# EAGLE design m1k-pot-divider (EAGLE 7.7.0)
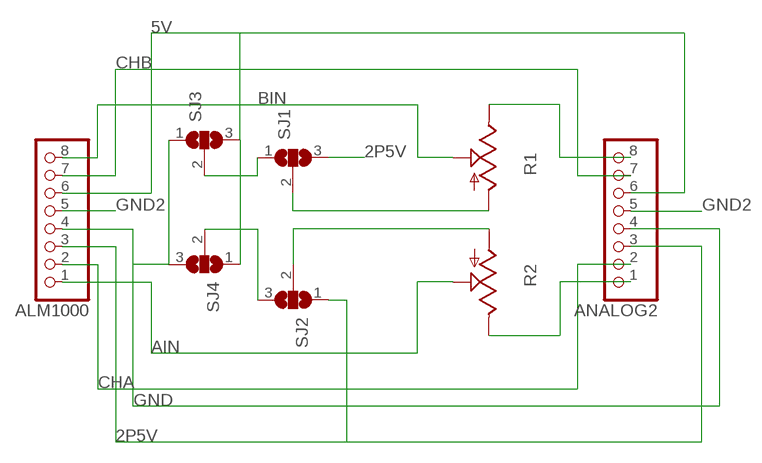
[diagram p0: schematic, sheet 1]

## Parts
ALM1000  PINHD-1X8  [1X08]
ANALOG2  PINHD-1X8  [1X08]
R1  TRIM_US-S64W  [S64W]
R2  TRIM_US-S64W  [S64W]
SJ1  SJ2W  [SJ_2]
SJ2  SJ2W  [SJ_2]
SJ3  SJ2W  [SJ_2]
SJ4  SJ2W  [SJ_2]

## Nets
2P5V: ALM1000.3 ANALOG2.3 SJ1.3 SJ2.1
5V: ALM1000.6 ANALOG2.6 SJ3.3 SJ4.1
AIN: ALM1000.1 R2.S
BIN: ALM1000.8 R1.S
CHA: ALM1000.2 ANALOG2.2
CHB: ALM1000.7 ANALOG2.7
GND: ALM1000.4 ANALOG2.4 SJ3.1 SJ4.3
GND2: ALM1000.5 ANALOG2.5
N$1: SJ1.1 SJ3.2
N$2: SJ2.3 SJ4.2
N$3: ANALOG2.1 R2.E
N$4: R1.A SJ1.2
N$5: R2.A SJ2.2
N$6: ANALOG2.8 R1.E

## Library data of the parts
ALM1000 ANALOG2 = pinhead:PINHD-1X8: PIN HEADER
R1 R2 = pot:TRIM_US-: POTENTIOMETER
SJ1-SJ4 = jumper:SJ2W: SMD solder JUMPER

## Board
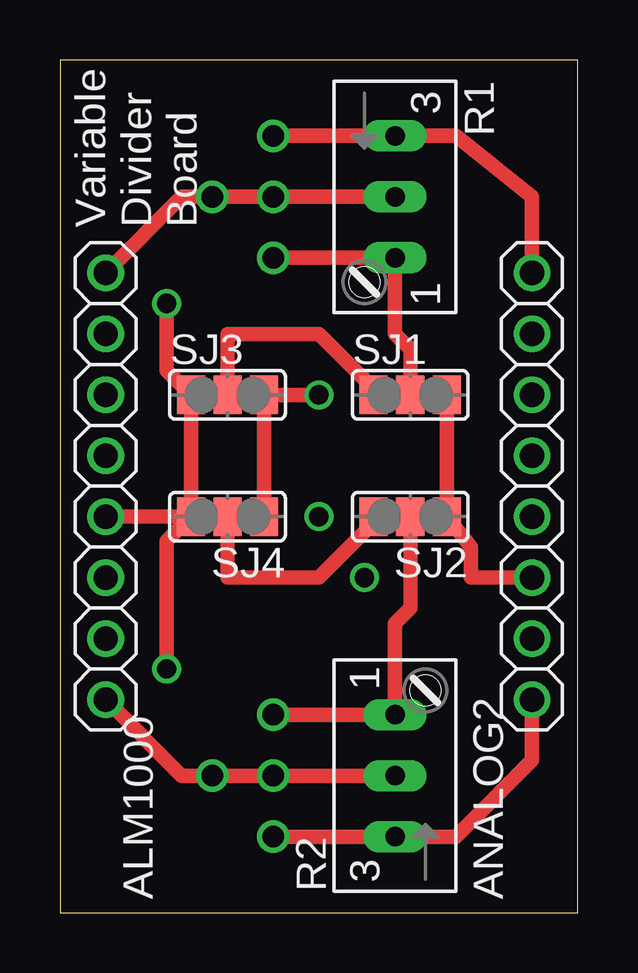
[diagram p1: board, top side]
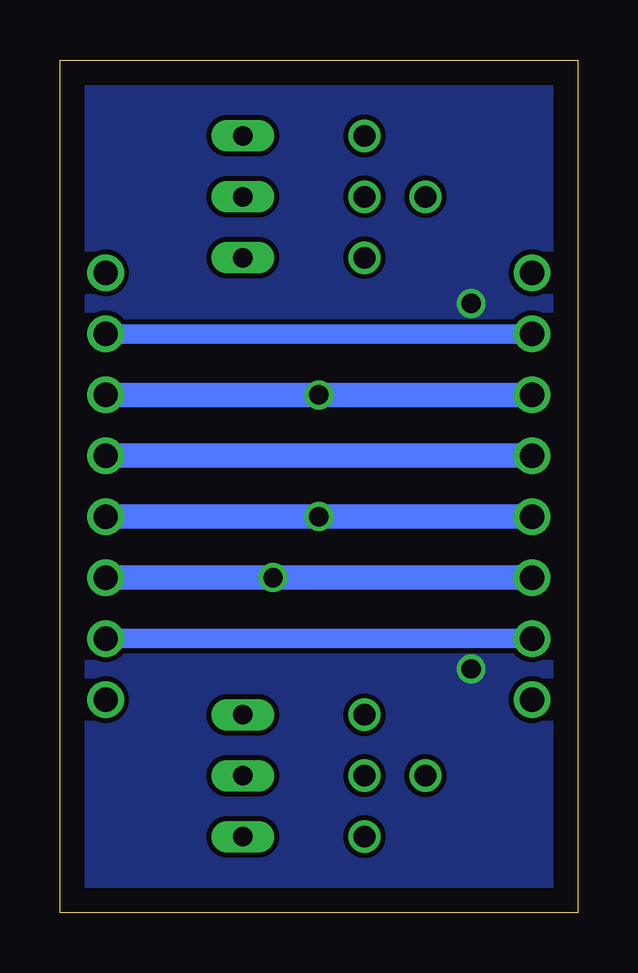
[diagram p2: board, bottom side, seen from below]

Size 21.59 x 35.55 mm. Coordinates in mm from the lower left corner, seen from the top.
Outline: 0,0 21.59,0 21.59,35.55 0,35.55 0,0
Copper layers (1*16): Top 0.035mm / dielectric 1.5mm / Bottom 0.035mm
Design rules "default": minimum track width 10mil, minimum drill 24mil, track to track 8mil, track to pad 8mil, pad to pad 8mil, via to via 8mil, smd to smd 8mil, copper to edge 40mil, drill to drill 8mil, minimum pad ring 10mil, minimum via ring 8mil, stop-mask expansion 4mil, vias tented up to drill 0mil, thermal gap 10mil

### Footprints (pad centres in the part's own frame; a part is rotated, then mirrored left to right if it is on the bottom)
1X08 = drill 1.016: 1 -8.89,0; 2 -6.35,0; 3 -3.81,0; 4 -1.27,0; 5 1.27,0; 6 3.81,0; 7 6.35,0; 8 8.89,0
S64W = drill 0.813 long: A 2.54,1.27; E -2.54,1.27; S 0,1.27
SJ_2 = smd 1.168 x 1.6: 1 -1.524,0; 2 0,0; 3 1.524,0

### Placement (x,y rotation side)
ALM1000  1.91,17.78 90 top
ANALOG2  19.68,17.78 90 top
R1  12.7,29.84 270 top
R2  15.24,5.71 90 top
SJ1  14.61,21.59 0 top
SJ2  14.61,16.51 180 top
SJ3  6.99,21.59 0 top
SJ4  6.99,16.51 180 top

### Tracks (layer width: path | path; a pad name or v marks a point on that pad's centre or on a via)
2P5V  (via drill 0.8)
  Top 0.61: ANALOG2.3 17.14,13.97 17.14,15.24 SJ2.1 SJ1.3
  Bottom 1.016: ALM1000.3 v12.7,13.97 ANALOG2.3
5V  (via drill 0.8)
  Top 0.61: v10.79,21.59 SJ3.3 SJ4.1
  Bottom 1.016: ALM1000.6 v10.79,21.59 ANALOG2.6
AIN  (via drill 0.9)
  Top 0.61: R2.S v8.89,5.71 v6.35,5.71 5.08,5.71 ALM1000.1
BIN  (via drill 0.9)
  Top 0.61: R1.S v8.89,29.84 v6.35,29.84 5.08,29.84 ALM1000.8
CHA
  Bottom 0.813: ALM1000.2 ANALOG2.2
CHB
  Bottom 0.813: ALM1000.7 ANALOG2.7
GND  (via drill 0.8)
  Top 0.61: 3.17,16.51 ALM1000.4 SJ4.3 | v4.45,10.16 4.45,15.49 SJ4.3 | SJ4.3 SJ3.1 4.45,22.61 v4.45,25.4
  Bottom 1.016: ALM1000.4 v10.79,16.51 ANALOG2.4
  pour Bottom: 0.64,12.7 0.64,0.64 20.95,0.64 20.95,12.7
  pour Bottom: 0.64,34.92 0.64,22.86 20.95,22.86 20.95,34.92
GND2
  Bottom 1.016: ALM1000.5 ANALOG2.5
N$1
  Top 0.61: SJ1.1 13.08,21.84 10.79,24.13 6.99,24.13 SJ3.2
N$2
  Top 0.61: SJ2.3 13.08,16.26 10.79,13.97 6.99,13.97 SJ4.2
N$3  (via drill 0.9)
  Top 0.61: ANALOG2.1 19.68,6.35 16.51,3.17 R2.E v8.89,3.17
N$4  (via drill 0.9)
  Top 0.61: SJ1.2 14.61,23.5 13.97,24.13 R1.A v8.89,27.3
N$5  (via drill 0.9)
  Top 0.61: SJ2.2 14.61,12.7 13.97,12.06 R2.A v8.89,8.26
N$6  (via drill 0.9)
  Top 0.61: ANALOG2.8 19.68,29.84 16.51,32.38 R1.E v8.89,32.38

### Text on the board
tPlace: Variable / Divider / Board